# EAGLE design expansion (EAGLE 8.2.1)
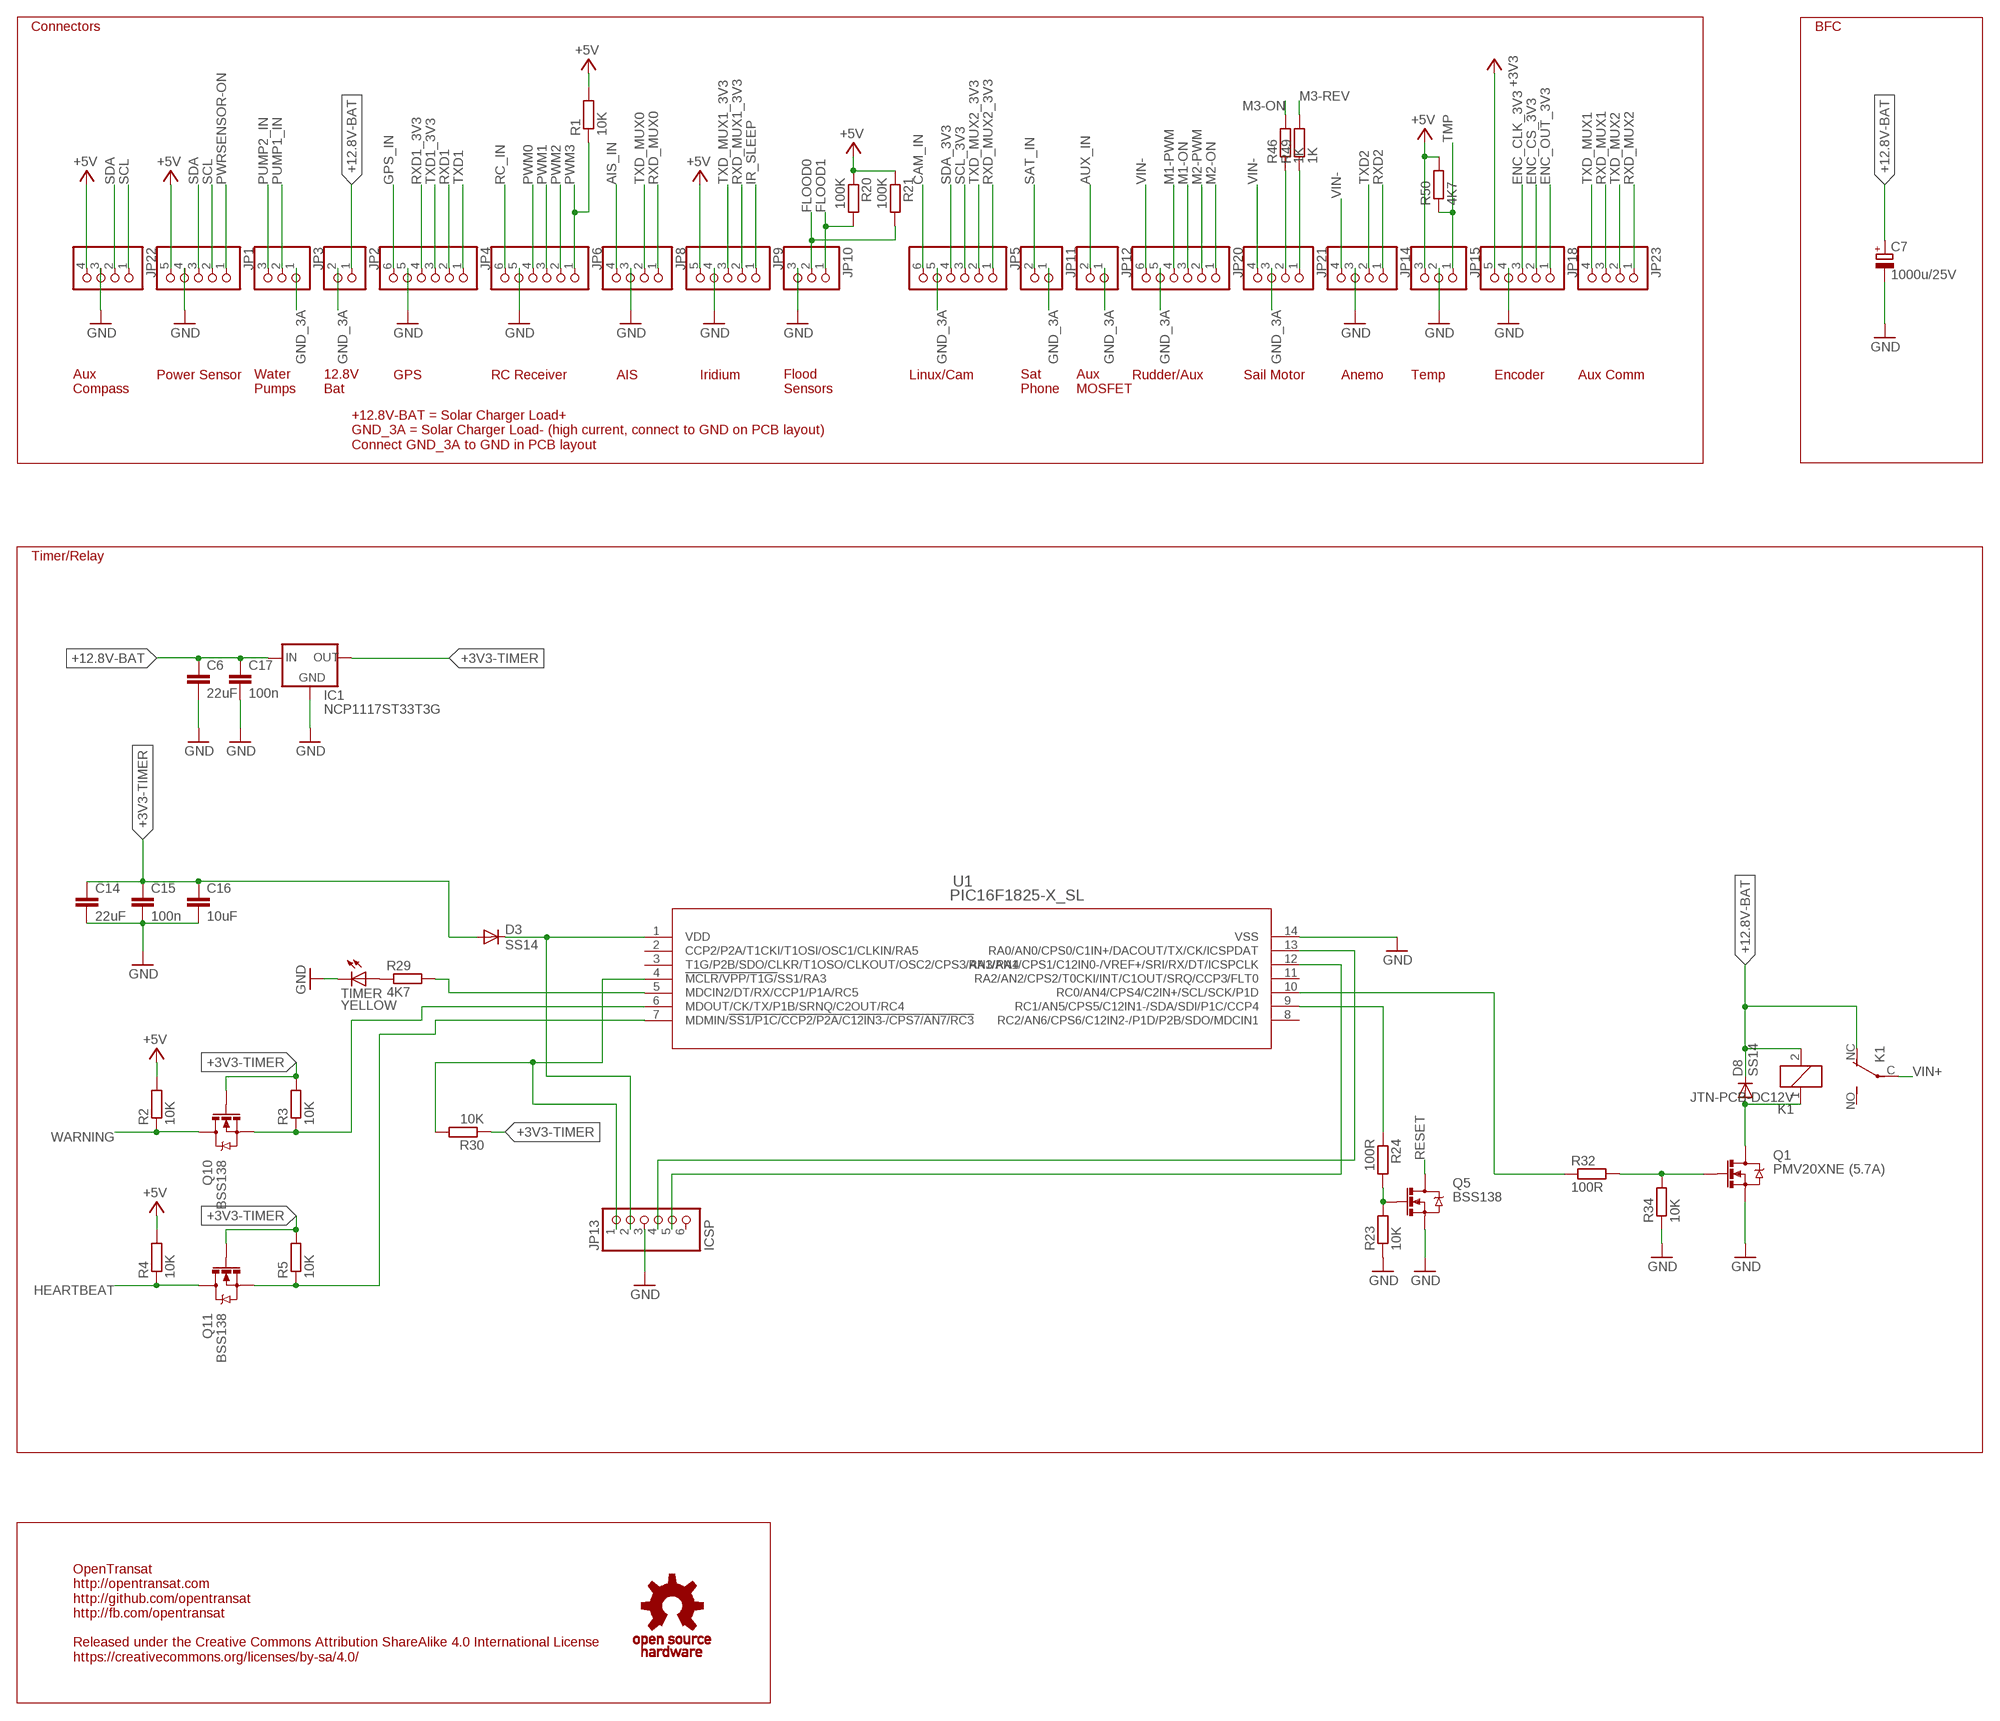
[diagram p0: schematic, sheet 1, part 1 of 2]
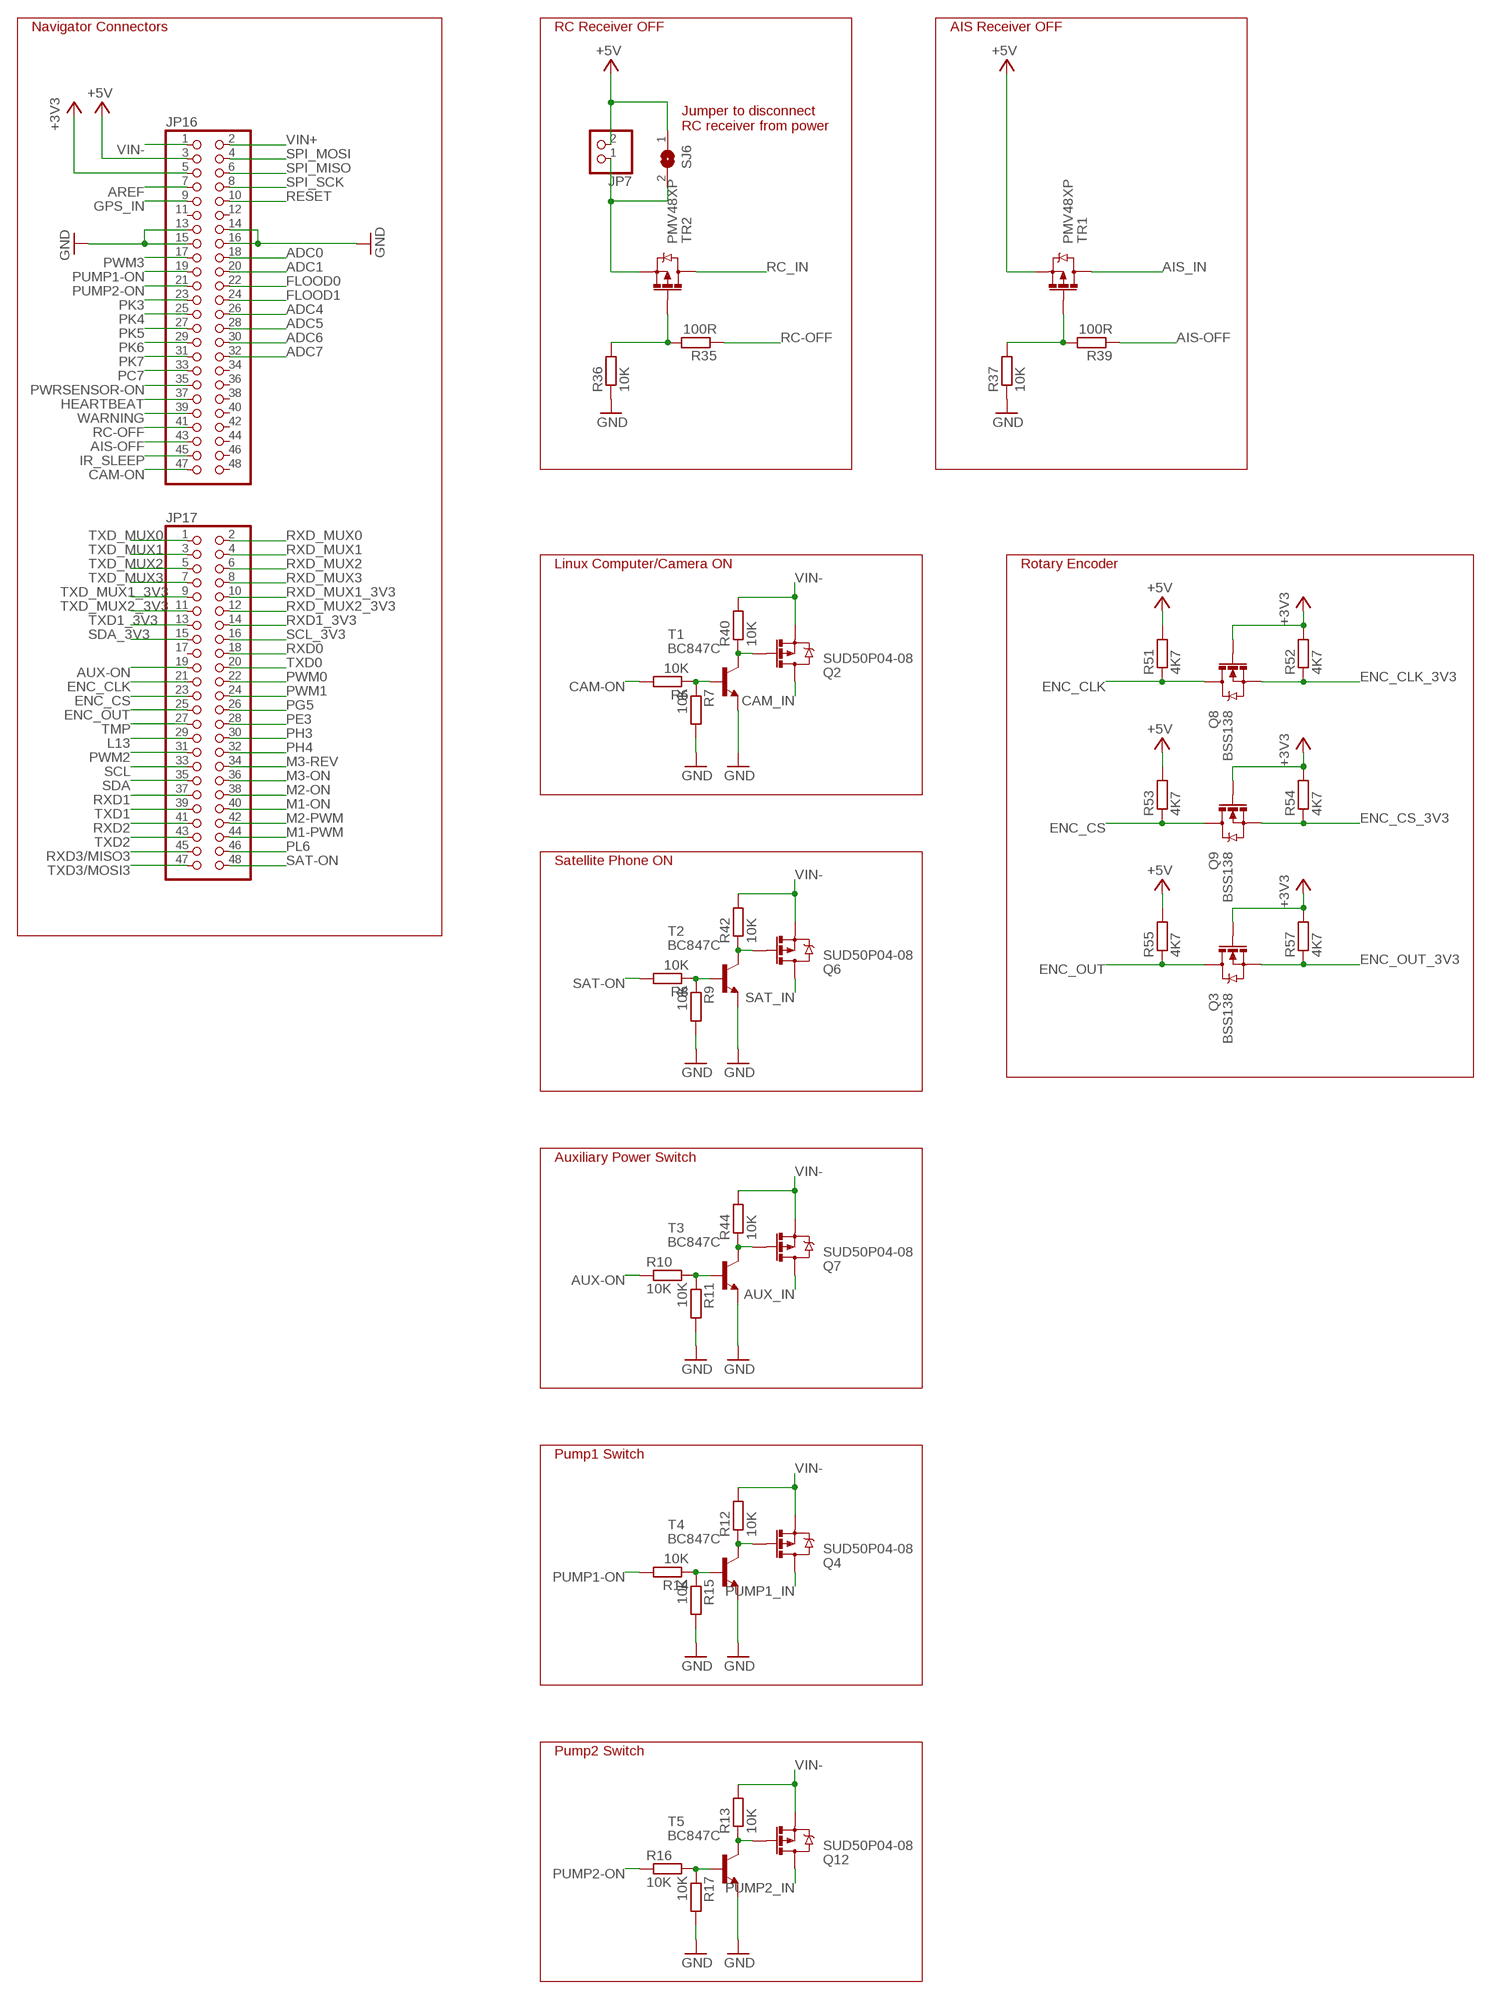
[diagram p1: schematic, sheet 1, part 2 of 2]

## Parts
C6  22uF  C-EUC1210  [C1210]
C7  1000u/25V  CPOL-EUE5-10.5  [E5-10,5]
C14  22uF  C-EUC1210  [C1210]
C15  100n  C-EUC0603  [C0603]
C16  10uF  C-EUC1206  [C1206]
C17  100n  C-EUC0603  [C0603]
D3  SS14  DIODE-DO214AC  [DO214AC]
D8  SS14  DIODE-DO214AC  [DO214AC]
IC1  NCP1117ST33T3G  LM1117MP-3.3  [SOT223]
JP1  PINHD-1X5  [1X05]
JP2  PINHD-1X2  [1X02]
JP3  PINHD-1X3  [1X03]
JP4  PINHD-1X6  [1X06]
JP5  PINHD-1X6  [1X06]
JP6  PINHD-1X6  [1X06]
JP7  PINHD-1X2  [1X02]
JP8  PINHD-1X4  [1X04]
JP9  PINHD-1X5  [1X05]
JP10  PINHD-1X3  [1X03]
JP11  PINHD-1X2  [1X02]
JP12  PINHD-1X2  [1X02]
JP13  ICSP  PINHD-1X6  [1X06]
JP14  PINHD-1X4  [1X04]
JP15  PINHD-1X3  [1X03]
JP16  PINHD-2X24  [2X24]
JP17  PINHD-2X24  [2X24]
JP18  PINHD-1X5  [1X05]
JP20  PINHD-1X6  [1X06]
JP21  PINHD-1X4  [1X04]
JP22  PINHD-1X4  [1X04]
JP23  PINHD-1X4  [1X04]
K1  JTN-PCB-DC12V  [JT-PCB]
Q1  PMV20XNE (5.7A)  MOSFET-NCHANNEL_SOT23-3  [SOT23-3]
Q2  SUD50P04-08  MOSFET-PCHANNEL_D-PAK  [D-PAK_TO252AA]
Q3  BSS138  MOSFET-NCHANNEL_SOT23-3  [SOT23-3]
Q4  SUD50P04-08  MOSFET-PCHANNEL_D-PAK  [D-PAK_TO252AA]
Q5  BSS138  MOSFET-NCHANNEL_SOT23-3  [SOT23-3]
Q6  SUD50P04-08  MOSFET-PCHANNEL_D-PAK  [D-PAK_TO252AA]
Q7  SUD50P04-08  MOSFET-PCHANNEL_D-PAK  [D-PAK_TO252AA]
Q8  BSS138  MOSFET-NCHANNEL_SOT23-3  [SOT23-3]
Q9  BSS138  MOSFET-NCHANNEL_SOT23-3  [SOT23-3]
Q10  BSS138  MOSFET-NCHANNEL_SOT23-3  [SOT23-3]
Q11  BSS138  MOSFET-NCHANNEL_SOT23-3  [SOT23-3]
Q12  SUD50P04-08  MOSFET-PCHANNEL_D-PAK  [D-PAK_TO252AA]
R1  10K  R-EU_R0603  [R0603]
R2  10K  R-EU_R0603  [R0603]
R3  10K  R-EU_R0603  [R0603]
R4  10K  R-EU_R0603  [R0603]
R5  10K  R-EU_R0603  [R0603]
R6  10K  R-EU_R0603  [R0603]
R7  10K  R-EU_R0603  [R0603]
R8  10K  R-EU_R0603  [R0603]
R9  10K  R-EU_R0603  [R0603]
R10  10K  R-EU_R0603  [R0603]
R11  10K  R-EU_R0603  [R0603]
R12  10K  R-EU_R0603  [R0603]
R13  10K  R-EU_R0603  [R0603]
R14  10K  R-EU_R0603  [R0603]
R15  10K  R-EU_R0603  [R0603]
R16  10K  R-EU_R0603  [R0603]
R17  10K  R-EU_R0603  [R0603]
R20  100K  R-EU_R0603  [R0603]
R21  100K  R-EU_R0603  [R0603]
R23  10K  R-EU_R0603  [R0603]
R24  100R  R-EU_R0603  [R0603]
R29  4K7  R-EU_R0603  [R0603]
R30  10K  R-EU_R0603  [R0603]
R32  100R  R-EU_R0603  [R0603]
R34  10K  R-EU_R0603  [R0603]
R35  100R  R-EU_R0603  [R0603]
R36  10K  R-EU_R0603  [R0603]
R37  10K  R-EU_R0603  [R0603]
R39  100R  R-EU_R0603  [R0603]
R40  10K  R-EU_R0603  [R0603]
R42  10K  R-EU_R0603  [R0603]
R44  10K  R-EU_R0603  [R0603]
R46  1K  R-EU_R0603  [R0603]
R49  1K  R-EU_R0603  [R0603]
R50  4K7  R-EU_R0603  [R0603]
R51  4K7  R-EU_R0603  [R0603]
R52  4K7  R-EU_R0603  [R0603]
R53  4K7  R-EU_R0603  [R0603]
R54  4K7  R-EU_R0603  [R0603]
R55  4K7  R-EU_R0603  [R0603]
R57  4K7  R-EU_R0603  [R0603]
SJ6  SJ  [SJ]
T1  BC847C  BC847  [SOT23]
T2  BC847C  BC847  [SOT23]
T3  BC847C  BC847  [SOT23]
T4  BC847C  BC847  [SOT23]
T5  BC847C  BC847  [SOT23]
TIMER  YELLOW  LEDCHIPLED_0805  [CHIPLED_0805]
TR1  PMV48XP  MOSFET-PCHANNEL_SOT23-3  [SOT23-3]
TR2  PMV48XP  MOSFET-PCHANNEL_SOT23-3  [SOT23-3]
U1  PIC16F1825-X_SL  [SOIC14-N_MC]
U$2  OSHW  [OSHWM]

## Nets
+3V3 [power 3.3V]: JP16.5 JP18.5 Q3.1(G) Q8.1(G) Q9.1(G) R52.2 R54.2 R57.2
+3V3-TIMER: C14.1 C15.1 C16.1 D3.A IC1.2(OUT) IC1.4(OUT) Q10.1(G) Q11.1(G) R3.2 R5.2 R30.1
+5V [power 5V]: JP1.5 JP7.2 JP9.5 JP15.3 JP16.3 JP22.4 R1.2 R2.2 R4.2 R20.1 R21.1 R50.2 R51.2 R53.2 R55.2 SJ6.1 TR1.2(S)
+12.8V-BAT [3A]: C6.1 C7.+ C17.1 D8.C IC1.3(IN) JP2.1 K1.2 K1.NC(O)
ADC0: JP16.18
ADC1: JP16.20
ADC4: JP16.26
ADC5: JP16.28
ADC6: JP16.30
ADC7: JP16.32
AIS-OFF: JP16.43 R39.1
AIS_IN: JP8.4 TR1.3(D)
AREF: JP16.7
AUX-ON: JP17.19 R10.1
AUX_IN [3A]: JP12.2 Q7.2(D)
CAM-ON: JP16.47 R6.2
CAM_IN [3A]: JP5.6 Q2.2(D)
ENC_CLK: JP17.21 Q8.3(D) R51.1
ENC_CLK_3V3: JP18.3 Q8.2(S) R52.1
ENC_CS: JP17.23 Q9.3(D) R53.1
ENC_CS_3V3: JP18.2 Q9.2(S) R54.1
ENC_OUT: JP17.25 Q3.3(D) R55.1
ENC_OUT_3V3: JP18.1 Q3.2(S) R57.1
FLOOD0: JP10.2 JP16.22 R21.2
FLOOD1: JP10.1 JP16.24 R20.2
GND [GND]: C6.2 C7.- C14.2 C15.2 C16.2 C17.2 IC1.1(GND) JP1.4 JP4.5 JP6.5 JP8.3 JP9.4 JP10.3 JP13.3 JP14.3 JP15.2 JP16.13 JP16.14 JP16.15 JP16.16 JP18.4 JP22.3 Q1.2(S) Q5.2(S) R7.2 R9.2 R11.2 R15.2 R17.2 R23.1 R34.1 R36.1 R37.1 T1.2(E) T2.2(E) T3.2(E) T4.2(E) T5.2(E) TIMER.C U1.14(VSS)
GND_3A [3A]: JP2.2 JP3.1 JP5.5 JP11.1 JP12.1 JP20.5 JP21.3
GPS_IN: JP4.6 JP16.9
HEARTBEAT: JP16.37 Q11.3(D) R4.1
IR_SLEEP: JP9.1 JP16.45
L13: JP17.29
M1-ON: JP17.40 JP20.3
M1-PWM: JP17.44 JP20.4
M2-ON: JP17.38 JP20.1
M2-PWM: JP17.42 JP20.2
M3-ON: JP17.36 R46.2
M3-REV: JP17.34 R49.2
N$1: R6.1 R7.1 T1.1(B)
N$2: Q10.2(S) R3.1 U1.6(MDOUT/CK/TX/P1B/SRNQ/C2OUT/RC4)
N$3: R8.1 R9.1 T2.1(B)
N$4: Q11.2(S) R5.1 U1.7(MDMIN/!SS1/P1C/CCP2/P2A/C12IN3-/CPS7/AN7/RC3)
N$5: R10.2 R11.1 T3.1(B)
N$6: Q4.1(G) R12.1 T4.3(C)
N$7: Q12.1(G) R13.1 T5.3(C)
N$8: R14.1 R15.1 T4.1(B)
N$9: R16.2 R17.1 T5.1(B)
N$21: JP21.2 R46.1
N$22: JP21.1 R49.1
N$30: JP13.4 U1.13(RA0/AN0/CPS0/C1IN+/DACOUT/TX/CK/ICSPDAT)
N$32: Q7.1(G) R44.1 T3.3(C)
N$33: Q6.1(G) R42.1 T2.3(C)
N$35: Q2.1(G) R40.1 T1.3(C)
N$36: JP13.1 R30.2 U1.4(!MCLR/VPP/T1G/!SS1/RA3)
N$37: JP13.5 U1.12(RA1/AN1/CPS1/C12IN0-/VREF+/SRI/RX/DT/ICSPCLK)
N$40: R32.1 U1.10(RC0/AN4/CPS4/C2IN+/SCL/SCK/P1D)
N$41: D3.C JP13.2 U1.1(VDD)
N$42: R24.1 U1.9(RC1/AN5/CPS5/C12IN1-/SDA/SDI/P1C/CCP4)
N$46: Q5.1(G) R23.2 R24.2
N$51: R29.2 U1.5(MDCIN2/DT/RX/CCP1/P1A/RC5)
N$52: R29.1 TIMER.A
N$53: Q1.1(G) R32.2 R34.2
N$54: JP7.1 SJ6.2 TR2.2(S)
N$55 [power 5V]: D8.A K1.1 Q1.3(D)
N$56: R35.2 R36.2 TR2.1(G)
N$76: R37.2 R39.2 TR1.1(G)
PC7: JP16.33
PE3: JP17.28
PG5: JP17.26
PH3: JP17.30
PH4: JP17.32
PK3: JP16.23
PK4: JP16.25
PK5: JP16.27
PK6: JP16.29
PK7: JP16.31
PL6: JP17.46
PUMP1-ON: JP16.19 R14.2
PUMP1_IN [3A]: JP3.2 Q4.2(D)
PUMP2-ON: JP16.21 R16.1
PUMP2_IN [3A]: JP3.3 Q12.2(D)
PWM0: JP6.4 JP17.22
PWM1: JP6.3 JP17.24
PWM2: JP6.2 JP17.31
PWM3: JP6.1 JP16.17 R1.1
PWRSENSOR-ON: JP1.1 JP16.35
RC-OFF: JP16.41 R35.1
RC_IN: JP6.6 TR2.3(D)
RESET: JP16.10 Q5.3(D)
RXD0: JP17.18
RXD1: JP4.2 JP17.37
RXD1_3V3: JP4.4 JP17.14
RXD2: JP14.1 JP17.41
RXD3/MISO3: JP17.45
RXD_MUX0: JP8.1 JP17.2
RXD_MUX1: JP17.4 JP23.3
RXD_MUX1_3V3: JP9.2 JP17.10
RXD_MUX2: JP17.6 JP23.1
RXD_MUX2_3V3: JP5.1 JP17.12
RXD_MUX3: JP17.8
SAT-ON: JP17.48 R8.2
SAT_IN [3A]: JP11.2 Q6.2(D)
SCL: JP1.2 JP17.33 JP22.1
SCL_3V3: JP5.3 JP17.16
SDA: JP1.3 JP17.35 JP22.2
SDA_3V3: JP5.4 JP17.15
SPI_MISO: JP16.6
SPI_MOSI: JP16.4
SPI_SCK: JP16.8
TMP: JP15.1 JP17.27 R50.1
TXD0: JP17.20
TXD1: JP4.1 JP17.39
TXD1_3V3: JP4.3 JP17.13
TXD2: JP14.2 JP17.43
TXD3/MOSI3: JP17.47
TXD_MUX0: JP8.2 JP17.1
TXD_MUX1: JP17.3 JP23.4
TXD_MUX1_3V3: JP9.3 JP17.9
TXD_MUX2: JP17.5 JP23.2
TXD_MUX2_3V3: JP5.2 JP17.11
TXD_MUX3: JP17.7
VIN+ [3A]: JP16.2 K1.C(P)
VIN- [3A]: JP14.4 JP16.1 JP20.6 JP21.4 Q2.3(S) Q4.3(S) Q6.3(S) Q7.3(S) Q12.3(S) R12.2 R13.2 R40.2 R42.2 R44.2
WARNING: JP16.39 Q10.3(D) R2.1
Unconnected: JP13.6 JP16.11 JP16.12 JP16.34 JP16.36 JP16.38 JP16.40 JP16.42 JP16.44 JP16.46 JP16.48 JP17.17 K1.NO(S) U1.2(CCP2/P2A/T1CKI/T1OSI/OSC1/CLKIN/RA5) U1.3(T1G/P2B/SDO/CLKR/T1OSO/CLKOUT/OSC2/CPS3/AN3/RA4) U1.8(RC2/AN6/CPS6/C12IN2-/P1D/P2B/SDO/MDCIN1) U1.11(RA2/AN2/CPS2/T0CKI/INT/C1OUT/SRQ/CCP3/FLT0)

## Notes on the sheet
- Connectors | BFC | Navigator Connectors | RC Receiver OFF | AIS Receiver OFF
- Jumper to disconnect
  RC receiver from power
- Power Sensor | GPS | RC Receiver | AIS | Iridium | Linux/Cam | Rudder/Aux | Sail Motor | Anemo | Temp | Encoder | Aux Comm
- Aux
  Compass
- Water
  Pumps
- 12.8V
  Bat
- Flood
  Sensors
- Sat
  Phone
- Aux
  MOSFET
- +12.8V-BAT = Solar Charger Load+
  GND_3A = Solar Charger Load- (high current, connect to GND on PCB layout)
  Connect GND_3A to GND in PCB layout
- Timer/Relay | Linux Computer/Camera ON | Rotary Encoder
- Satellite Phone ON
- Auxiliary Power Switch
- Pump1 Switch
- OpenTransat
  http://opentransat.com
  http://github.com/opentransat
  http://fb.com/opentransat
  
  Released under the Creative Commons Attribution ShareAlike 4.0 International License
  https://creativecommons.org/licenses/by-sa/4.0/
- Pump2 Switch

## Library data of the parts
C6 C14-C17 = rcl:C-EU: CAPACITOR, European symbol
C7 = transducer:CPOL-EU: POLARIZED CAPACITOR, European symbol
D3 D8 = diode:DIODE-: DIODE
IC1 = lm1117_10:LM1117?-*: 800mA Low-Dropout Linear Regulator Source: http://www.ti.com/lit/ds/symlink/lm1117-n.pdf; MF: Texas Instruments; MPN: LM1117MP-3.3; OC_FARNELL: 9778195; OC_NEWARK: 28X3416
JP1 JP9 JP18 = pinhead:PINHD-1X5: PIN HEADER
JP2 JP7 JP11 JP12 = pinhead:PINHD-1X2: PIN HEADER
JP3 JP10 JP15 = pinhead:PINHD-1X3: PIN HEADER
JP4-JP6 JP13 JP20 = pinhead:PINHD-1X6: PIN HEADER
JP8 JP14 JP21-JP23 = pinhead:PINHD-1X4: PIN HEADER
JP16 JP17 = pinhead:PINHD-2X24: PIN HEADER
K1 = relay:JT?-*: COMPACT ECONOMICAL 30 AMP. RELAY NAiS Source: http://www.mew-europe.com/.. en_ds_61212_0000.pdf; OC_FARNELL: unknown; OC_NEWARK: unknown
Q1 Q3 Q5 Q8-Q11 = Simplex-DiscreteSemi:MOSFET-NCHANNEL: Generic N-channel mosfet
Q2 Q4 Q6 Q7 Q12 TR1 TR2 = Simplex-DiscreteSemi:MOSFET-PCHANNEL: Generic P-channel mosfet
R1-R17 R20 R21 R23 R24 R29 R30 R32 R34-R37 R39 R40 R42 R44 R46 R49-R55 R57 = rcl:R-EU_: RESISTOR, European symbol
SJ6 = jumper:SJ: SMD solder JUMPER
T1-T5 = transistor:BC847: NPN TRANSISTOR
TIMER = led:LED: LED OSRAM: - CHIPLED LG R971, LG N971, LY N971, LG Q971, LY Q971, LO R971, LY R971 LH N974, LH R974 LS Q976, LO Q976, LY Q976 LO Q996 - Hyper CHIPLED LW Q18S LB Q993, LB Q99A, LB R99A - SideLED LS A670, LO A670, LY A670, LG A670, LP A670 LB A673, LV A673, LT A673, LW A673 LH A674 LY A675 LS A676, LA A676, LO A676, LY A676, LW A676 LS A679, LY A679, LG A679 - Hyper Micro SIDELED® LS Y876, LA Y876, LO Y876, LY Y876 LT Y87S - SmartLED LW L88C, LW L88S LB L89C, LB L89S, LG L890 LS L89K, LO L89K, LY L89K LS L896, LA L896, LO L896, LY L896 - TOPLED LS T670, LO T670, LY T670, LG T670, LP T670 LSG T670, LSP T670, LSY T670, LOP T670, LYG T670 LG T671, LOG T671, LSG T671 LB T673, LV T673, LT T673, LW T673 LH T674 LS T676, LA T676, LO T676, LY T676, LB T676, LH T676, LSB T676, LW T676 LB T67C, LV T67C, LT T67C, LS T67K, LO T67K, LY T67K, LW E67C LS E67B, LA E67B, LO E67B, LY E67B, LB E67C, LV E67C, LT E67C LW T67C LS T679, LY T679, LG T679 LS T770, LO T770, LY T770, LG T770, LP T770 LB T773, LV T773, LT T773, LW T773 LH T774 LS E675, LA E675, LY E675, LS T675 LS T776, LA T776, LO T776, LY T776, LB T776 LHGB T686 LT T68C, LB T68C - Hyper Mini TOPLED® LB M676 - Mini TOPLED Santana® LG M470 LS M47K, LO M47K, LY M47K Source: http://www.osram.convergy.de LUXEON: - LUMILED® LXK2-PW12-R00, LXK2-PW12-S00, LXK2-PW14-U00, LXK2-PW14-V00 LXK2-PM12-R00, LXK2-PM12-S00, LXK2-PM14-U00 LXK2-PE12-Q00, LXK2-PE12-R00, LXK2-PE12-S00, LXK2-PE14-T00, LXK2-PE14-U00 LXK2-PB12-K00, LXK2-PB12-L00, LXK2-PB12-M00, LXK2-PB14-N00, LXK2-PB14-P00, LXK2-PB14-Q00 LXK2-PR12-L00, LXK2-PR12-M00, LXK2-PR14-Q00, LXK2-PR14-R00 LXK2-PD12-Q00, LXK2-PD12-R00, LXK2-PD12-S00 LXK2-PH12-R00, LXK2-PH12-S00 LXK2-PL12-P00, LXK2-PL12-Q00, LXK2-PL12-R00 Source: www.luxeon.com KINGBRIGHT: KA-3528ASYC Source: www.kingbright.com
U1 = PIC16F1825:PIC16F1825-X_SL
U$2 = oshw:OSHW

## Net classes
1 power 5V: width 0.305 mm, drill 0.508 mm, clearance 0.203 mm
2 power 3.3V: width 0.305 mm, drill 0.508 mm, clearance 0.203 mm
3 GND: width 0.305 mm, drill 0.508 mm, clearance 0.203 mm
4 3A: width 1.372 mm, drill 1.219 mm, clearance 0.406 mm

## Board
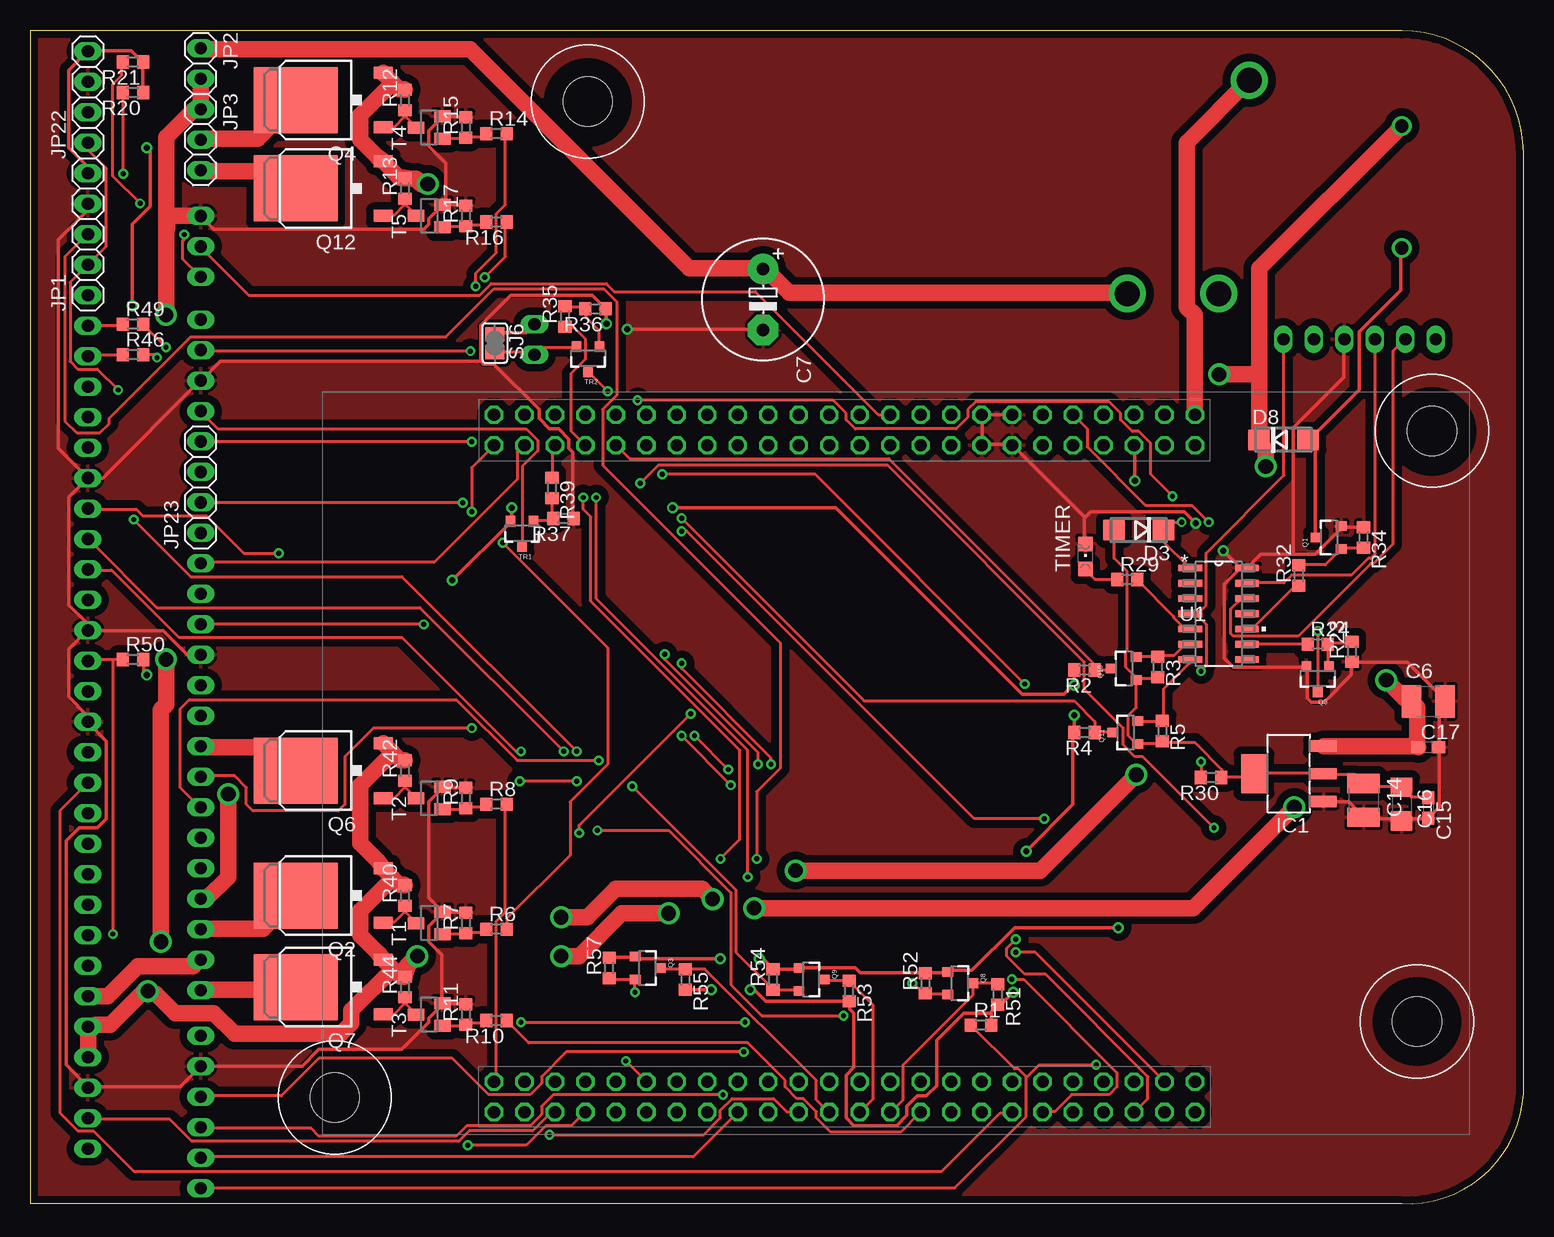
[diagram p2: board, top side]
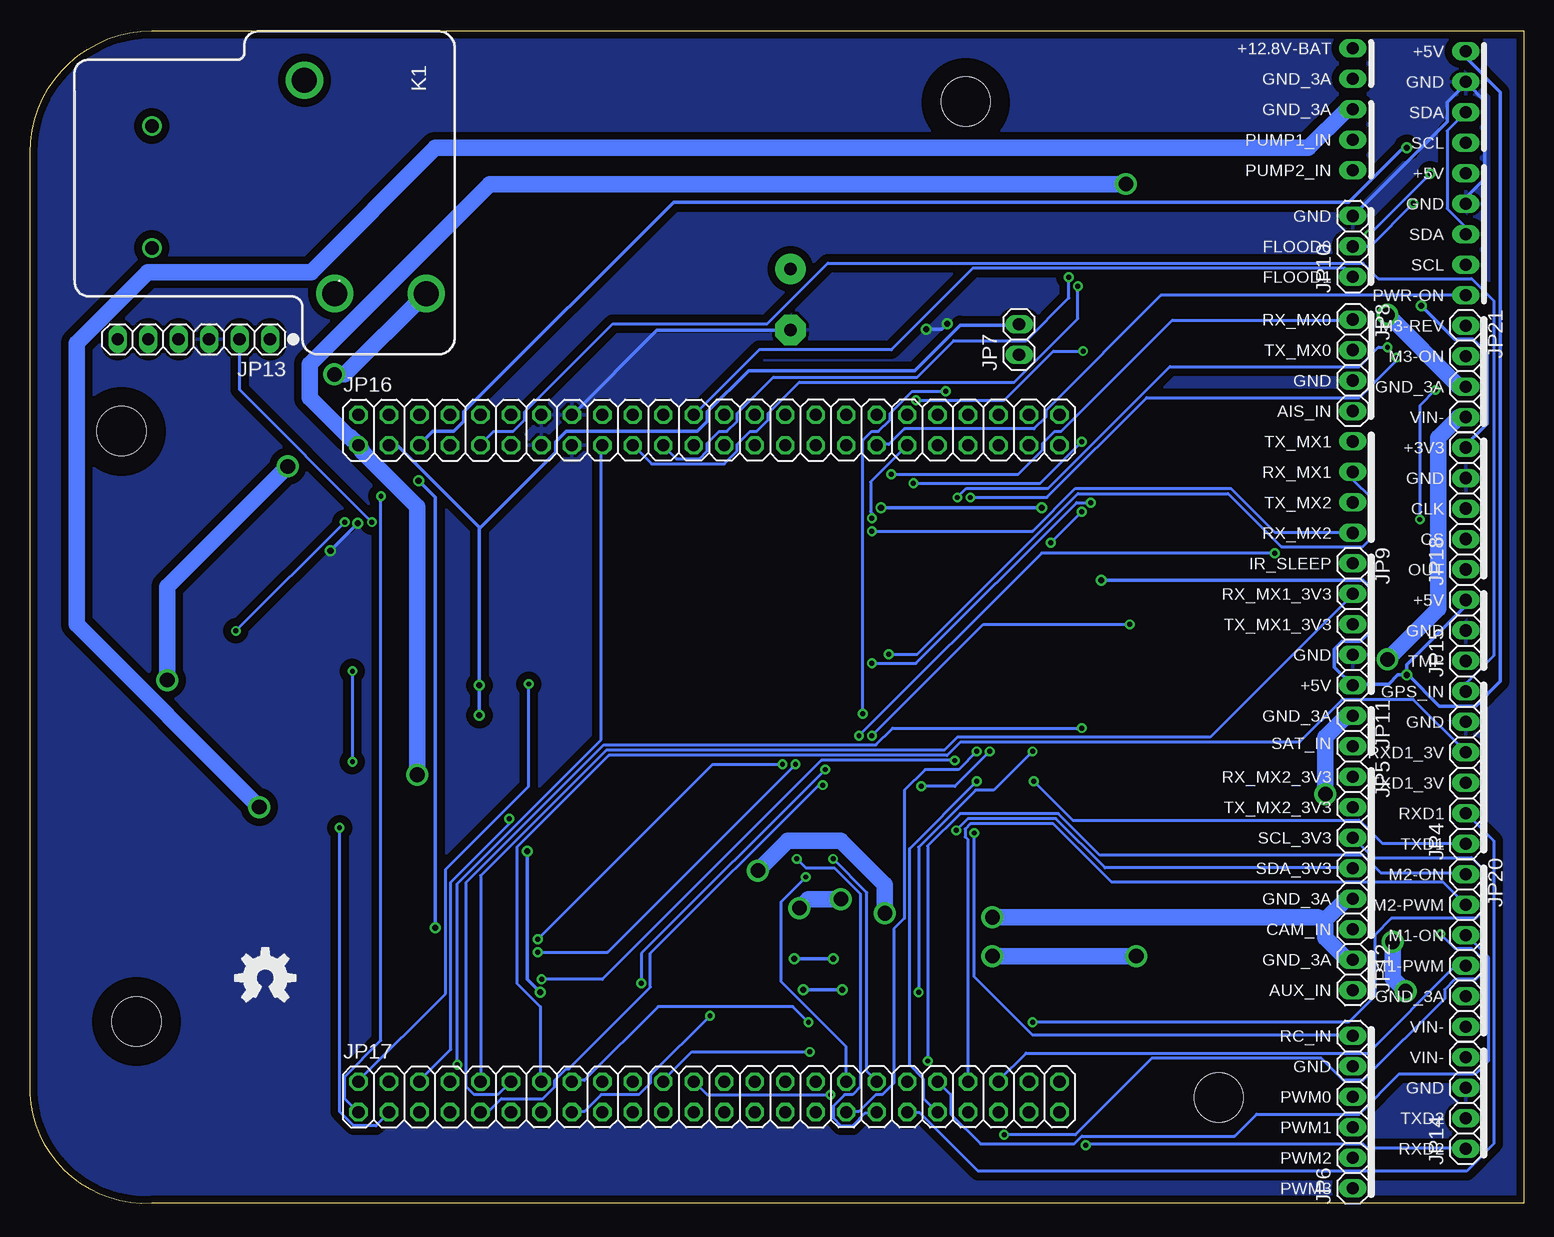
[diagram p3: board, bottom side, seen from below]

Size 124.46 x 97.73 mm. Coordinates in mm from the lower left corner, seen from the top.
Outline: 0,0.01 114.3,0.01 arc90 124.46,9.15 124.46,87.57 arc90 114.3,97.73 0,97.73 0,0.01
Copper layers (1*16): Top 0.035mm / dielectric 0.5mm / Bottom 0.035mm
Design rules "autorouter *": minimum track width 10mil, minimum drill 16mil, track to track 7mil, track to pad 7mil, pad to pad 8mil, via to via 8mil, smd to smd 8mil, copper to edge 15mil, drill to drill 12mil, minimum pad ring 10mil, minimum via ring 8mil, stop-mask expansion 1mil, vias tented up to drill 30mil, thermal gap 10mil
Holes 4.1 mm at 116.84,64.39 115.57,15.18 25.4,8.83 46.48,91.83
tRestrict: area 112.5,12.1 to 118.6,18.2; area 113.8,61.3 to 119.9,67.4; area 22.4,5.8 to 28.4,11.9; area 43.4,88.7 to 49.5,94.8
bRestrict: area 113.8,61.3 to 119.9,67.4; area 112.5,12.1 to 118.6,18.2; area 22.4,5.8 to 28.4,11.9; area 43.4,88.7 to 49.5,94.8

### Footprints (pad centres in the part's own frame; a part is rotated, then mirrored left to right if it is on the bottom)
C1210 = smd 1.6 x 2.7: 1 -1.4,0; 2 1.4,0
E5-10,5 = drill 1.016 pad 2.54: + -2.54,0 | drill 1.016 pad 2.54 octagon: - 2.54,0
C0603 = smd 1.1 x 1: 1 -0.85,0; 2 0.85,0
C1206 = smd 1.6 x 1.8: 1 -1.4,0; 2 1.4,0
DO214AC = smd 1.8 x 1.7: A 2.05,0; C -2.05,0
SOT223 = smd 0.95 x 2.15: 1 -2.3,-2.9; 2 0,-2.9; 3 2.3,-2.9 | smd 3.25 x 2.15: 4 0,2.9
1X05 = drill 1.016 long: 1 -5.08,0; 2 -2.54,0; 3 0,0; 4 2.54,0; 5 5.08,0
1X02 = drill 1.016 long: 1 -1.27,0; 2 1.27,0
1X03 = drill 1.016 long: 1 -2.54,0; 2 0,0; 3 2.54,0
1X06 = drill 1.016 long: 1 -6.35,0; 2 -3.81,0; 3 -1.27,0; 4 1.27,0; 5 3.81,0; 6 6.35,0
1X04 = drill 1.016 long: 1 -3.81,0; 2 -1.27,0; 3 1.27,0; 4 3.81,0
2X24 = drill 1.016 octagon: 1 -27.94,-1.27; 2 -27.94,1.27; 3 -25.4,-1.27; 4 -25.4,1.27; 5 -22.86,-1.27; 6 -22.86,1.27; 7 -20.32,-1.27; 8 -20.32,1.27; 9 -17.78,-1.27; 10 -17.78,1.27; 11 -15.24,-1.27; 12 -15.24,1.27; 13 -12.7,-1.27; 14 -12.7,1.27; 15 -10.16,-1.27; 16 -10.16,1.27; 17 -7.62,-1.27; 18 -7.62,1.27; 19 -5.08,-1.27; 20 -5.08,1.27; 21 -2.54,-1.27; 22 -2.54,1.27; 23 0,-1.27; 24 0,1.27; 25 2.54,-1.27; 26 2.54,1.27; 27 5.08,-1.27; 28 5.08,1.27; 29 7.62,-1.27; 30 7.62,1.27; 31 10.16,-1.27; 32 10.16,1.27; 33 12.7,-1.27; 34 12.7,1.27; 35 15.24,-1.27; 36 15.24,1.27; 37 17.78,-1.27; 38 17.78,1.27; 39 20.32,-1.27; 40 20.32,1.27; 41 22.86,-1.27; 42 22.86,1.27; 43 25.4,-1.27; 44 25.4,1.27; 45 27.94,-1.27; 46 27.94,1.27; 47 30.48,-1.27; 48 30.48,1.27
JT-PCB = drill 1.1: 1 5.08,0; 2 -5.08,0 | drill 2.1: C -8.89,12.7; NC 8.89,22.86; NO 8.89,15.24
SOT23-3 = smd 0.8 x 0.9: 1 -0.95,-1; 2 0.95,-1; 3 0,1.1
D-PAK_TO252AA = smd 1 x 1.6: 1 -2.28,-4.8; 3 2.28,-4.8 | smd 5.5 x 7: 2 0,2.5
R0603 = smd 1 x 1.1: 1 -0.85,0; 2 0.85,0
SJ = smd 1.168 x 1.6: 1 -0.762,0; 2 0.762,0
SOT23 = smd 1 x 1.4: 1 -0.95,-1.1; 2 0.95,-1.1; 3 0,1.1
CHIPLED_0805 = smd 1.2 x 1.2: A 0,-1.05; C 0,1.05
SOIC14-N_MC = smd 1.981 x 0.559: 1 -2.362,3.81; 2 -2.362,2.54; 3 -2.362,1.27; 4 -2.362,0; 5 -2.362,-1.27; 6 -2.362,-2.54; 7 -2.362,-3.81; 8 2.362,-3.81; 9 2.362,-2.54; 10 2.362,-1.27; 11 2.362,0; 12 2.362,1.27; 13 2.362,2.54; 14 2.362,3.81

### Placement (x,y rotation side)
C6  116.52,41.85 0 top
C7  61.09,75.34 270 top
C14  111.12,33.6 270 top
C15  116.52,32.96 270 top
C16  114.3,33.28 270 top
C17  116.52,38.04 0 top
D3  92.39,56.14 180 top
D8  104.46,63.63 0 top
IC1  104.9,35.82 90 top
JP1  4.83,80.78 90 top
JP2  14.22,95 270 top
JP3  14.22,88.65 270 top
JP4  4.83,36.33 90 bottom
JP5  14.22,29.22 270 bottom
JP6  14.22,7.63 90 bottom
JP7  42.04,72.01 90 bottom
JP8  14.22,69.86 270 bottom
JP9  14.22,48.27 270 bottom
JP10  14.22,79.76 90 bottom
JP11  14.22,39.38 270 bottom
JP12  14.22,19.06 270 bottom
JP13  110.81,72.01 180 bottom
JP14  4.83,8.39 90 bottom
JP15  4.83,47.76 90 bottom
JP16  69.14,64.46 0 bottom
JP17  69.14,8.89 0 bottom
JP18  4.83,57.92 90 bottom
JP20  4.83,21.09 270 bottom
JP21  4.83,69.35 270 bottom
JP22  4.83,92.21 90 top
JP23  14.22,59.7 90 top
K1  114.3,84.71 270 bottom
Q1  108.27,55.5 90 top
Q2  24.64,25.66 90 top
Q3  51.44,19.63 270 top
Q4  24.64,91.95 90 top
Q5  107.31,43.76 180 top
Q6  24.64,36.07 90 top
Q7  24.64,18.04 90 top
Q8  77.47,18.36 270 top
Q9  65.09,18.67 270 top
Q10  91.19,44.58 90 top
Q11  91.31,39.25 90 top
Q12  24.64,84.59 90 top
R1  79.25,14.86 0 top
R2  87.88,44.46 180 top
R3  93.98,44.71 270 top
R4  87.88,39.25 180 top
R5  94.36,39.38 270 top
R6  38.86,22.87 0 top
R7  36.32,23.37 90 top
R8  38.86,33.28 0 top
R9  36.32,33.79 90 top
R10  38.86,15.25 180 top
R11  36.32,15.75 90 top
R12  31.24,91.95 90 top
R13  31.24,84.59 90 top
R14  38.86,89.16 0 top
R15  36.32,89.67 90 top
R16  38.86,81.79 180 top
R17  36.32,82.3 90 top
R20  8.57,92.59 180 top
R21  8.57,95.13 180 top
R23  110.17,45.98 90 top
R24  107.31,46.61 0 top
R29  91.44,52.01 0 top
R30  98.42,35.5 180 top
R32  105.73,52.33 90 top
R34  111.12,55.5 270 top
R35  44.58,73.92 90 top
R36  47.12,74.55 180 top
R37  44.45,57.09 180 top
R39  43.5,59.63 270 top
R40  31.24,25.66 90 top
R42  31.24,36.07 90 top
R44  31.24,18.04 90 top
R46  8.57,70.74 0 top
R49  8.57,73.28 0 top
R50  8.57,45.34 0 top
R51  80.64,17.4 270 top
R52  74.61,18.36 90 top
R53  68.26,17.72 270 top
R54  61.91,18.67 90 top
R55  54.61,18.67 270 top
R57  48.26,19.63 90 top
SJ6  38.73,71.7 270 top
T1  33.27,23.37 90 top
T2  33.27,33.79 90 top
T3  33.27,15.75 90 top
T4  33.27,89.67 90 top
T5  33.27,82.3 90 top
TIMER  87.95,53.92 0 top
TR1  41.01,55.85 180 top
TR2  46.51,70.43 180 top
U1  99.06,49.15 0 top
U$2  104.86,18.8 0 top

### Tracks (layer width: path | path; a pad name or v marks a point on that pad's centre or on a via)
+3V3  (via drill 0.51)
  Top 0.305: R57.2 48.36,20.52 50.41,20.52 Q3.1 50.52,20.41 v57.54,20.41 | v60.78,20.41 61.1,20.41 61.85,19.65 R54.2 61.96,19.54 64.01,19.54 Q9.1 64.23,19.65 68.76,19.65 69.2,19.22 74.49,19.22 R52.2 74.7,19.22 76.43,19.22 Q8.1 76.54,19.44 78.48,19.44 82.04,23 v90.68,23 | v8.53,74.81 8.53,81.62 10.04,83.13 10.04,87.66 v9.72,87.98 | v92.08,60.24 92.08,63.16 JP16.5
  Bottom 0.305: v60.78,20.41 v57.54,20.41 | v8.53,74.81 5.72,72.01 4.21,72.01 3.02,70.82 3.02,64.99 4.75,63.26 4.75,63.05 JP18.5 | v9.72,87.98 10.04,87.98 14.57,83.45 70.81,83.45 88.3,65.96 88.3,65.21 89.17,64.34 90.89,64.34 91.97,63.26 JP16.5 | v90.68,23 90.68,58.84 v92.08,60.24
+3V3-TIMER
  Top 0.254: C15.1 116.48,33.9 115.08,33.9 114.32,34.66 C16.1 114.21,34.77 111.4,34.77 111.19,34.98 C14.1 111.08,35.09 110.43,35.74 107.84,35.74 IC1.2 107.73,35.84 102.12,35.84 IC1.4 101.91,35.74 101.69,35.52 99.31,35.52 R30.1 99.31,35.63 99.31,36.17 97.05,38.44 94.46,38.44 R5.2 94.35,38.44 94.24,38.33 92.41,38.33 Q11.1 92.19,38.33 91.54,38.98 91.54,40.7 92.19,41.35 92.19,43.51 Q10.1 | Q10.1 92.19,43.73 93.81,43.73 93.92,43.83 R3.2 | D3.A 90.35,56.14 90.35,53.76 91.43,52.69 91.43,46.1 91.33,45.99 91.33,44.7 92.19,43.83 Q10.1
+5V  (via drill 0.51)
  Top 0.305: R20.1 9.39,92.63 9.39,95.11 R21.1 9.28,95.22 8.42,96.08 4.86,96.08 JP22.4 4.75,95.97 3.24,94.46 3.24,87.98 4.75,86.47 4.75,85.93 JP1.5 | v35.19,51.93 40.05,56.79 TR1.2 40.16,56.9 v40.16,57.97 | v9.72,44.05 9.5,44.27 9.5,45.34 R50.2 | 80.1,15.87 80.1,15.98 80.64,16.52 R51.2 80.75,16.63 80.96,16.63 v81.93,17.6 | 80.1,15.87 80.1,14.9 R1.2 | 80.1,15.87 77.83,15.87 75.56,13.61 75.56,9.83 74.7,8.97 73.95,8.97 73.08,8.1 73.08,7.35 72.22,6.48 68.66,6.48 68.01,7.13 68.01,10.69 68.66,11.34 68.66,15.87 68.33,16.2 68.33,16.85 R53.2 68.12,16.85 61.32,16.85 60.34,17.82 v60.02,17.82 | v56.78,17.82 54.62,17.82 R55.2 | SJ6.1 38.75,72.55 41.34,72.55 41.99,73.2 JP7.2 | v87.01,40.7 87.01,39.3 R4.2 86.9,39.19 86.9,33.25 v83.01,29.37 | R2.2 87.01,44.37 v87.01,43.19 86.9,43.19 86.14,42.43 82.69,42.43 67.14,57.97 v53.54,57.97
  Bottom 0.305: v35.19,51.93 13.39,51.93 12.63,51.17 12.63,47.83 13.6,46.86 15.11,46.86 15.76,46.21 15.76,44.7 14.25,43.19 JP9.5 14.14,43.29 11.23,43.29 10.47,44.05 v9.72,44.05 | v9.72,44.05 9.72,44.91 4.86,49.77 4.86,50.2 JP15.3 | JP22.4 4.75,95.97 4.75,95.43 1.94,92.63 1.94,43.51 3.99,41.46 7.02,41.46 9.61,44.05 v9.72,44.05 | v60.02,17.82 v56.78,17.82 | v87.01,40.7 v87.01,43.19 87.01,56.36 | 87.01,56.36 93.81,63.16 94.46,63.16 JP16.3 | JP7.2 42.1,73.2 46.96,73.2 50.74,69.42 64.55,69.42 68.01,65.96 68.01,65.21 68.87,64.34 79.78,64.34 80.64,63.48 80.64,62.62 86.9,56.36 87.01,56.36 | v81.93,17.6 83.01,18.68 v83.01,29.37 | v53.54,57.97 v40.16,57.97
+12.8V-BAT  (via drill 1.22)
  Top 1.372: 115.61,38.11 115.61,41.35 115.18,41.78 C6.1 114.53,42.11 v113.02,43.62 | 115.61,38.11 C17.1 | 115.61,38.11 107.84,38.11 IC1.3 | 102.44,69.09 102.44,77.95 114.21,89.71 K1.2 | 102.44,69.09 102.44,63.7 D8.C 102.77,63.05 102.98,62.83 v102.98,61.43 | JP2.1 14.25,96.19 36.7,96.19 54.95,77.95 60.99,77.95 C7.+ 61.64,77.51 63.26,75.89 91.43,75.89 K1.NC | v99.1,69.09 102.44,69.09
  Bottom 1.372: v113.02,43.62 113.02,51.39 v102.98,61.43 | v99.1,69.09 98.23,69.09 91.54,75.79 K1.NC
AIS-OFF
  Top 0.254: R39.1 43.5,60.57 43.5,62.94 43.72,63.16 JP16.43
AIS_IN
  Top 0.254: TR1.3 41.02,54.84 41.02,61.43 42.32,62.72 42.32,63.59 41.34,64.56 15.65,64.56 14.25,65.96 JP8.4
AUX-ON
  Top 0.254: R10.1 39.73,15.23 41.56,13.39 59.8,13.39 62.94,10.26 62.94,9.72 63.91,8.75 64.45,8.75 65.53,7.67 65.53,7.13 66.71,5.94 72.54,5.94 74.16,7.56 JP17.19
AUX_IN
  Top 1.372: JP12.2 14.25,17.82 21.91,17.82 Q7.2
CAM-ON  (via drill 0.41)
  Top 0.254: v39.4,55.06 48.15,46.32 48.15,36.6 45.02,33.47 45.02,29.04 39.73,23.75 39.73,22.89 R6.2 | v36.81,57.65 36.81,61.32 38.65,63.16 JP16.47
  Bottom 0.254: v36.81,57.65 v39.4,55.06
CAM_IN
  Top 1.372: JP5.6 14.25,22.89 19.43,22.89 22.13,25.59 Q2.2
ENC_CLK
  Top 0.254: R51.1 80.64,18.36 Q8.3 78.59,18.25 78.59,17.39 72.76,11.56 72.76,8.64 71.79,7.67 JP17.21
ENC_CLK_3V3  (via drill 0.41)
  Top 0.254: Q8.2 76.43,17.49 74.7,17.49 R52.1 74.49,17.49 73.62,18.36 v73.51,18.36 | v55.38,38.98 v58.19,36.17 | v20.73,54.2 17.81,54.2 14.68,57.33 9.39,57.33 8.85,57.87 4.86,57.87 JP18.3
  Bottom 0.254: v73.51,18.36 73.51,20.84 v58.19,36.17 | v55.38,38.98 40.16,54.2 v20.73,54.2
ENC_CS
  Top 0.254: Q9.3 66.28,18.57 68.22,18.57 R53.1 68.33,18.46 70.28,16.52 70.28,8.75 69.2,7.67 JP17.23
ENC_CS_3V3  (via drill 0.41)
  Top 0.254: Q9.2 64.01,17.82 61.96,17.82 R54.1 61.85,17.93 58.83,20.95 58.83,26.13 v50.2,34.77 | v44.48,37.68 32.49,49.66 10.58,49.66 4.86,55.38 JP18.2
  Bottom 0.254: v50.2,34.77 47.39,34.77 v44.48,37.68
ENC_OUT
  Top 0.254: Q3.3 52.57,19.54 54.52,19.54 R55.1 54.73,19.54 56.24,19.54 65.53,10.26 65.53,8.64 66.5,7.67 JP17.25
ENC_OUT_3V3  (via drill 0.41)
  Top 0.254: R57.1 48.36,18.68 50.41,18.68 Q3.2 50.41,18.57 v50.41,17.6 | v40.91,37.68 40.48,37.68 30.98,47.18 12.41,47.18 6.8,52.79 4.86,52.79 JP18.1
  Bottom 0.254: v50.41,17.6 50.41,29.69 45.66,34.44 44.15,34.44 v40.91,37.68
FLOOD0  (via drill 0.41)
  Top 0.254: v9.18,83.34 6.91,85.61 6.91,93.27 7.66,94.03 7.66,95.11 R21.2 | JP16.22 71.68,65.75 70.71,65.75 60.45,76 48.69,76 48.04,76.65 38.43,76.65 37.46,75.68 18.24,75.68 14.25,79.67 JP10.2
  Bottom 0.254: v9.18,83.34 12.74,79.78 14.14,79.78 JP10.2
FLOOD1  (via drill 0.41)
  Top 0.254: v7.77,85.83 7.77,92.52 R20.2 | v12.85,80.75 12.85,80.32 12.74,80.21 12.74,78.7 14.14,77.3 JP10.1
  Bottom 0.254: v12.85,80.75 v7.77,85.83 | JP16.24 69.09,65.75 63.69,71.14 52.68,71.14 45.88,77.95 14.9,77.95 14.25,77.3 JP10.1
GND  (via drill 0.51)
  Top 0.305: IC1.1 107.84,33.47 109.89,33.47 111.08,32.28 C14.2 111.19,32.07 114.21,32.07 C16.2 114.32,31.96 114.43,32.07 116.48,32.07 C15.2 116.59,32.17 117.45,33.04 117.45,38 C17.2 117.45,38.11 117.45,41.35 117.88,41.78 C6.2 117.88,42 114.75,45.13 110.33,45.13 R23.1 110.11,45.13 110.11,44.05 107.84,41.78 106.76,41.78 106.44,42.11 106.44,44.7 Q5.2 106.22,44.7 100.29,44.7 99.53,45.45 99.53,51.61 100.83,52.9 101.36,52.9 U1.14 | R34.1 111.08,56.36 109.35,56.36 Q1.2 109.25,56.25 107.09,54.09 105.25,54.09 | 105.25,54.09 102.55,54.09 101.47,53.01 U1.14 | 105.25,54.09 105.25,64.67 109.46,68.88 109.46,72.01 JP13.3 | R9.2 36.27,34.66 34.44,34.66 T2.2 34.33,34.55 33.25,33.47 33.25,25.48 34.33,24.4 T1.2 | R11.2 36.27,16.63 34.44,16.63 T3.2 | R7.2 36.27,24.29 34.44,24.29 T1.2 | T3.2 34.33,16.85 34.33,20.73 33.25,21.81 33.25,23.11 34.33,24.19 T1.2 | T3.2 34.33,16.52 33.25,15.44 33.25,15.12 30.98,12.85 24.07,12.85 22.67,11.45 14.36,11.45 JP6.5 14.14,11.34 12.52,9.72 4.86,9.72 JP14.3 4.75,9.83 3.02,11.56 3.02,30.23 4.1,31.31 5.61,31.31 6.37,32.07 6.37,38.54 4.86,40.05 JP4.5 4.75,40.16 4.75,40.7 3.24,42.21 3.24,46.21 4.75,47.72 JP15.2 | JP16.14 81.83,65.75 79.45,65.75 JP16.16 79.34,65.64 79.34,63.26 JP16.15 79.45,63.26 81.72,63.26 JP16.13 81.93,63.16 87.87,57.22 | 87.87,57.22 87.87,55.06 TIMER.C | R17.2 36.27,83.23 34.44,83.23 T5.2 | R15.2 36.27,90.58 34.44,90.58 T4.2 34.33,90.47 33.25,89.39 33.25,88.09 34.65,86.69 34.65,83.34 T5.2 | T5.2 34.33,83.13 33.25,82.05 33.25,81.62 32.82,81.18 15.33,81.18 14.25,82.26 JP10.3 | 37.57,70.17 37.78,69.96 38.65,69.96 42.42,66.18 42.42,65.42 43.29,64.56 44.04,64.56 44.91,63.7 44.91,62.94 45.23,62.62 45.23,57.11 R37.1
  Top 0.305: 37.57,70.17 37.57,73.2 40.05,75.68 46.85,75.68 47.93,74.6 R36.1 48.04,74.49 v48.04,73.3 | JP9.4 14.14,45.78 13.06,45.78 11.12,47.72 4.97,47.72 JP15.2 | JP18.4 6.04,60.46 14.14,68.55 JP8.3 14.36,68.66 15.87,70.17 37.57,70.17 | JP15.2 4.64,47.83 4.64,48.48 3.24,49.88 3.24,58.84 4.75,60.35 JP18.4 | JP1.4 4.75,83.23 4.75,82.7 2.38,80.32 2.38,62.94 4.75,60.57 JP18.4 | v49.77,72.87 60.99,72.87 C7.- | v99.42,54.41 100.83,53.01 U1.14 | v97.16,56.68 96.18,57.65 88.41,57.65 87.98,57.22 87.87,57.22
  Top 1.372: JP10.3 11.43,82.3 11.43,81.29
  Bottom 0.305: C7.- 61.1,72.76 72.22,72.76 79.23,65.75 JP16.16 | JP1.4 4.75,83.34 4.75,83.88 3.24,85.39 3.24,91.87 4.75,93.38 JP22.3 4.86,93.27 6.37,91.76 6.37,90.14 14.14,82.37 JP10.3 | v49.77,72.87 48.47,72.87 v48.04,73.3 | v97.16,56.68 v99.42,54.41
  pour Top (isolate 0.635): -2.03,-2.53 127,-2.53 127,100.27 -2.03,100.27
  pour Bottom (isolate 0.635): -4.57,-5.07 129.54,-5.07 129.54,103.13 -4.57,103.13
GND_3A  (via drill 1.22)
  Top 1.372: JP20.5 6.48,17.28 8.96,19.76 13.6,19.76 14.14,20.3 JP12.1 | v16.52,34.12 16.52,27.21 14.79,25.48 14.25,25.48 JP5.5 | v11.34,74.06 11.34,88.85 13.6,91.12 14.14,91.12 JP3.1 14.25,91.87 14.25,93.71 JP2.2 | v44.26,23.86 46.42,23.86 48.79,26.24 56.03,26.24 v56.89,25.37 | v60.34,24.62 96.94,24.62 v105.36,33.04
  Bottom 1.372: 16.52,23.65 14.79,25.37 14.25,25.37 JP5.5 | 16.52,23.65 16.52,22.14 14.79,20.41 14.25,20.41 JP12.1 | v16.52,34.12 16.52,38.87 14.79,40.59 14.25,40.59 JP11.1 | v11.34,74.06 5.4,68.12 4.86,68.12 JP21.3 | v44.26,23.86 17.16,23.86 16.52,23.65 | v56.89,25.37 59.59,25.37 v60.34,24.62 | v105.36,33.04 120.58,48.26 120.58,71.68 114.64,77.62 101.04,77.62 90.68,87.98 17.92,87.98 14.79,91.12 14.25,91.12 JP3.1
GNDX2  (1 unrouted)
GPS_IN
  Bottom 0.254: JP4.6 4.75,42.75 4.75,43.4 2.48,45.67 2.48,75.25 4.32,77.08 12.09,77.08 13.39,78.38 57.97,78.38 63.04,73.3 75.89,73.3 83.23,65.96 83.23,65.32 84.2,64.34 85.82,64.34 86.9,63.26 JP16.9
HEARTBEAT  (via drill 0.41)
  Top 0.254: Q11.3 90.14,39.3 88.73,39.3 R4.1 88.73,39.41 88.73,40.16 87.01,41.89 69.52,41.89 v54.3,57.11
  Bottom 0.254: v54.3,57.11 54.3,57.54 54.41,57.65 54.41,60.13 51.38,63.16 JP16.37
IR_SLEEP
  Top 0.254: JP9.1 14.25,53.44 33.68,53.44 40.59,60.35 40.59,62.62 41.13,63.16 JP16.45
M1-ON
  Bottom 0.254: JP20.3 4.75,22.35 2.92,20.52 2.92,11.88 3.99,10.8 10.36,10.8 13.71,7.45 22.24,7.45 24.07,5.62 36.81,5.62 37.46,4.97 45.23,4.97 47.71,7.45 47.71,9.07 48.79,10.15 JP17.40
M1-PWM
  Bottom 0.254: JP20.4 4.86,19.76 5.72,19.76 12.95,12.53 41.45,12.53 43.72,10.26 JP17.44
M2-ON  (via drill 0.41)
  Top 0.254: v49.66,11.88 51.28,10.26 JP17.38
  Bottom 0.254: v49.66,11.88 49.66,29.8 46.96,32.5 38.75,32.5 35.3,29.04 13.39,29.04 11.87,27.53 4.86,27.53 JP20.1
M2-PWM
  Bottom 0.254: JP17.42 46.31,10.26 46.31,30.34 46.53,30.56 46.53,31.2 46.09,31.63 39.19,31.63 34.33,26.78 6.69,26.78 4.86,24.94 JP20.2
M3-ON  (via drill 0.41)
  Top 0.254: v10.58,70.5 10.36,70.71 9.5,70.71 R46.2 | v46.09,58.84 46.09,57.87 46.74,57.22 46.74,50.2 59.16,37.79 59.16,30.34 v57.54,28.72
  Bottom 0.254: v10.58,70.5 10.58,70.28 13.71,67.15 31.41,67.15 39.73,58.84 v46.09,58.84 | v57.54,28.72 54.73,25.91 54.73,11.02 53.98,10.26 JP17.36
M3-REV  (via drill 0.41)
  Top 0.254: v11.34,71.36 9.5,73.2 R49.2 | v47.17,58.84 47.17,50.42 59.8,37.79 v59.8,27.21
  Bottom 0.254: v11.34,71.36 12.09,71.36 13.71,69.74 29.47,69.74 39.62,59.59 46.42,59.59 v47.17,58.84 | v59.8,27.21 61.85,25.16 61.85,18.46 56.46,13.07 56.46,10.26 JP17.34
N$1
  Top 0.254: R6.1 38,22.78 37.78,22.57 36.38,22.57 R7.1 36.27,22.46 34.44,22.46 T1.1
N$2
  Top 0.254: Q10.2 92.19,45.56 93.92,45.56 R3.1 94.02,45.67 95.32,45.67 96.18,46.53 96.61,46.53 U1.6
N$3
  Top 0.254: R8.1 38,33.25 37.78,33.04 36.38,33.04 R9.1 36.27,32.82 34.44,32.82 T2.1
N$4
  Top 0.254: Q11.2 92.41,40.16 94.35,40.16 R5.1 94.46,40.27 94.46,42.86 96.61,45.02 96.61,45.34 U1.7
N$5
  Top 0.254: R10.2 38,15.23 37.78,15.01 36.38,15.01 R11.1 36.27,14.79 34.44,14.79 T3.1
N$6
  Top 0.254: 31.3,90.58 31.3,91.01 R12.1 | 31.3,90.58 32.17,89.71 T4.3 | Q4.1 29.47,89.71 30.33,89.71 31.2,90.58 31.3,90.58
N$7
  Top 0.254: 31.3,83.23 31.3,83.67 R13.1 | 31.3,83.23 32.17,82.37 T5.3 | Q12.1 29.47,82.37 30.33,82.37 31.2,83.23 31.3,83.23
N$8
  Top 0.254: R14.1 38,89.06 37.78,88.85 36.38,88.85 R15.1 36.27,88.74 34.44,88.74 T4.1
N$9
  Top 0.254: R16.2 38,81.72 37.78,81.51 36.38,81.51 R17.1 36.27,81.4 34.44,81.4 T5.1
N$21
  Top 0.254: R46.1 7.66,70.71 4.86,70.71 JP21.2
N$22
  Top 0.254: R49.1 7.66,73.2 4.86,73.2 JP21.1
N$30
  Top 0.254: U1.13 101.47,51.71 104.5,51.71 105.14,52.36 110.11,52.36 111.51,53.76 111.73,53.76 112.05,54.09 112.05,72.01 JP13.4
N$32
  Top 0.254: 31.3,16.63 31.3,17.17 R44.1 | 31.3,16.63 T3.3 | Q7.1 29.47,15.77 30.33,15.77 31.2,16.63 31.3,16.63
N$33
  Top 0.254: 31.3,34.66 31.3,35.2 R42.1 | 31.3,34.66 T2.3 | Q6.1 29.47,33.79 30.33,33.79 31.2,34.66 31.3,34.66
N$35
  Top 0.254: 31.3,24.29 31.3,24.73 R40.1 | 31.3,24.29 32.17,23.43 T1.3 | Q2.1 29.47,23.43 30.33,23.43 31.2,24.29 31.3,24.29
N$36  (via drill 0.41)
  Top 0.254: v97.59,36.82 97.59,35.52 R30.2 | v97.59,44.37 98.02,44.8 98.02,48.26 97.16,49.12 96.72,49.12 U1.4 97.26,49.12 98.02,49.88 98.02,54.2 104.5,60.67 104.5,72.01 JP13.1
  Bottom 0.254: v97.59,44.37 v97.59,36.82
N$37
  Top 0.254: U1.12 101.36,50.42 100.93,50.42 100.07,49.55 100.07,47.5 100.29,47.29 105.68,47.29 111.73,53.33 111.94,53.33 113.56,54.95 113.56,71.04 114.53,72.01 JP13.5
N$40
  Top 0.254: R32.1 105.68,51.39 105.36,51.39 101.91,47.94 101.47,47.94 U1.10
N$41  (via drill 0.41)
  Top 0.254: U1.1 96.61,53.01 94.46,55.17 94.46,56.14 D3.C 94.56,56.14 95.21,56.79 v95.97,56.79
  Bottom 0.254: v95.97,56.79 106.98,67.8 106.98,72.01 JP13.2
N$42
  Top 0.254: R24.1 106.44,46.64 101.47,46.64 U1.9
N$46
  Top 0.254: Q5.1 108.17,44.8 108.17,46.53 R24.2 108.27,46.64 108.38,46.75 110.11,46.75 R23.2
N$51
  Top 0.254: R29.2 92.3,51.93 95.32,48.91 95.32,48.8 96.18,47.94 96.61,47.94 U1.5
N$52
  Top 0.254: R29.1 90.57,52.04 88.73,52.04 87.98,52.79 TIMER.A
N$53
  Top 0.254: R34.2 111.08,54.63 109.35,54.63 Q1.1 109.25,54.52 107.95,53.22 105.79,53.22 R32.2
N$54
  Top 0.254: TR2.2 45.55,71.36 42.64,71.36 42.1,70.82 JP7.1 42.1,70.93 38.75,70.93 SJ6.2
N$55
  Top 0.305: Q1.3 107.09,55.6 107.09,63.05 106.55,63.59 D8.A 106.66,63.7 110.76,67.8 110.76,72.66 114.21,76.11 114.21,79.56 K1.1
N$56
  Top 0.254: TR2.1 47.39,71.47 47.39,72.76 46.31,73.84 46.31,74.49 R36.2 46.2,74.6 46.09,74.71 44.58,74.71 R35.2
N$76
  Top 0.254: TR1.1 41.99,56.9 43.4,56.9 43.5,57 R37.2 43.5,57.11 43.5,58.73 R39.2
PUMP1-ON  (via drill 0.41)
  Top 0.254: v37.13,76.43 37.13,77.51 38.86,79.24 38.86,82.48 39.62,83.23 39.62,89.06 R14.2
  Bottom 0.254: v37.13,76.43 37.13,73.74 42.42,68.45 60.34,68.45 62.94,65.86 62.94,65.32 63.91,64.34 64.45,64.34 65.53,63.26 65.53,62.72 66.61,61.64 72.65,61.64 74.16,63.16 JP16.19
PUMP1_IN
  Top 1.372: JP3.2 14.25,88.74 19,88.74 22.13,91.87 Q4.2
PUMP2-ON  (via drill 0.41)
  Top 0.254: v37.89,77.19 39.62,78.92 39.62,81.72 R16.1
  Bottom 0.254: v37.89,77.19 37.89,75.46 41.45,71.9 47.5,71.9 50.52,68.88 62.5,68.88 65.53,65.86 65.53,65.21 66.39,64.34 67.04,64.34 68.01,63.37 68.01,62.72 68.66,62.08 70.6,62.08 71.68,63.16 JP16.21
PUMP2_IN
  Top 1.372: JP3.3 14.25,86.04 20.73,86.04 22.13,84.64 Q12.2
PWM0  (via drill 0.41)
  Top 0.254: v59.48,12.64 44.69,12.64 42.64,10.58 42.64,10.04 41.67,9.07 38.21,9.07 35.19,12.1 24.07,12.1 20.94,8.97 14.25,8.97 JP6.4
  Bottom 0.254: v59.48,12.64 69.3,12.64 71.68,10.26 JP17.22
PWM1  (via drill 0.41)
  Top 0.254: v57.75,9.07 43.61,9.07 42.64,8.1 42.64,7.45 41.67,6.48 36.38,6.48 35.52,5.62 24.07,5.62 23.43,6.27 14.25,6.27 JP6.3
  Bottom 0.254: v57.75,9.07 68.01,9.07 69.09,10.15 JP17.24
PWM2
  Top 0.254: JP6.2 14.25,3.89 55.27,3.89 58.94,7.56 JP17.31
PWM3  (via drill 0.41)
  Top 0.254: 83.01,10.58 82.37,11.23 82.04,11.23 78.48,14.79 R1.1 | 83.01,10.58 83.01,7.24 77.08,1.3 14.25,1.3 JP6.1 | v88.84,11.56 84.09,11.56 83.12,10.58 83.01,10.58
  Bottom 0.254: v88.84,11.56 88.84,26.67 76.86,38.65 76.86,63.16 JP16.17
PWRSENSOR-ON
  Bottom 0.254: JP16.35 53.87,63.26 52.9,63.26 51.6,64.56 40.8,64.56 39.83,65.53 39.83,66.07 30.23,75.68 4.86,75.68 JP1.1
RC-OFF
  Top 0.254: R35.1 44.58,72.98 45.34,72.98 46.31,72.01 46.31,70.39 45.12,69.2 45.12,64.34 46.2,63.26 JP16.41
RC_IN  (via drill 0.41)
  Top 0.254: v48.15,67.69 46.53,69.31 TR2.3 | v55.05,40.81 45.77,31.53 v45.77,30.88
  Bottom 0.254: v48.15,67.69 50.95,67.69 52.79,65.86 52.79,65.32 53.76,64.34 54.3,64.34 55.05,63.59 v55.05,40.81 | v45.77,30.88 45.77,18.9 40.91,14.04 14.25,14.04 JP6.6
RESET  (via drill 0.41)
  Top 0.254: v107.3,47.72 107.3,42.75 Q5.3 | v98.23,56.79 96.83,58.19 92.94,58.19 88.09,63.05 88.09,64.56 87.01,65.64 JP16.10
  Bottom 0.254: v98.23,56.79 v107.3,47.72
RXD1
  Bottom 0.254: JP17.37 51.28,7.56 50.3,7.56 45.45,2.7 4.75,2.7 2.48,4.97 2.48,30.23 4.75,32.5 JP4.2
RXD1_3V3
  Bottom 0.254: JP17.14 81.93,10.26 81.93,16.41 83.88,18.36 83.88,29.69 76.21,37.36 48.04,37.36 46.96,38.44 18.68,38.44 15.11,42 9.18,42 4.86,37.68 JP4.4
RXD2  (via drill 0.41)
  Top 0.254: v36.49,4.86 41.34,4.86 42.96,6.48 45.12,6.48 46.2,7.56 JP17.41
  Bottom 0.254: v36.49,4.86 36.38,4.97 13.39,4.97 13.06,4.65 4.86,4.65 JP14.1
RXD_MUX0  (via drill 0.41)
  Top 0.254: v52.68,60.78 65.42,60.78 v82.91,43.29
  Bottom 0.254: v52.68,60.78 42.1,60.78 40.05,62.83 40.05,63.37 39.08,64.34 38.54,64.34 29.25,73.63 14.25,73.63 JP8.1 | v82.91,43.29 82.91,34.77 89.81,27.86 89.81,17.49 97.05,10.26 JP17.2
RXD_MUX1  (via drill 0.41)
  Top 0.254: v52.9,45.78 52.9,45.34 60.67,37.57 v60.67,36.6 | v82.15,20.95 83.77,20.95 94.46,10.26 JP17.4
  Bottom 0.254: v52.9,45.78 50.52,45.78 37.13,59.16 24.61,59.16 20.19,54.74 13.39,54.74 12.74,55.38 12.74,58.84 14.14,60.24 14.14,60.89 JP23.3 | v60.67,36.6 76.32,20.95 v82.15,20.95
RXD_MUX1_3V3
  Bottom 0.254: JP17.10 86.9,10.26 86.9,27.32 76.43,37.79 48.25,37.79 47.17,38.87 26.12,38.87 14.25,50.74 JP9.2
RXD_MUX2  (via drill 0.41)
  Top 0.254: v54.3,56.03 54.73,56.03 78.7,32.07 v84.53,32.07
  Bottom 0.254: v54.3,56.03 40.91,56.03 37.35,59.59 24.4,59.59 20.73,55.92 14.25,55.92 JP23.1 | v84.53,32.07 84.53,31.63 89.38,26.78 89.38,12.85 91.97,10.26 JP17.6
RXD_MUX2_3V3  (via drill 0.41)
  Top 0.254: v36.81,39.62 28.61,39.62 26.23,37.25 26.23,33.25 25.69,32.71 18.57,32.71 18.03,33.25 18.03,34.66 17.06,35.63 14.25,35.63 JP5.1
  Bottom 0.254: v36.81,39.62 52.57,39.62 53.98,38.22 76.64,38.22 88.09,26.78 88.09,9.72 87.44,9.07 85.5,9.07 84.42,10.15 JP17.12
SAT-ON
  Top 0.254: R8.2 39.62,33.25 39.62,24.29 38.86,23.54 38.86,10.37 38.75,10.26 JP17.48
SAT_IN
  Top 1.372: JP11.2 14.25,38 20.3,38 22.13,36.17 Q6.2
SCL  (via drill 0.41)
  Top 0.254: v45.55,37.68 30.98,52.25 13.39,52.25 v8.64,57 | v7.34,67.8 5.61,69.53 3.99,69.53 3.35,70.17 3.35,76.76 JP1.2 6.37,79.78 6.37,86.26 4.86,87.77 4.86,88.31 JP22.1
  Bottom 0.254: v45.55,37.68 47.07,36.17 49.87,36.17 51.6,34.44 51.6,23.75 52.46,22.89 52.46,10.04 53.44,9.07 53.98,9.07 55.38,7.67 56.35,7.67 JP17.33 | v8.64,57 8.64,66.5 v7.34,67.8
SCL_3V3  (via drill 0.41)
  Top 0.254: v40.91,15.12 v59.59,15.12
  Bottom 0.254: v59.59,15.12 60.88,16.41 72.11,16.41 78.26,10.26 79.23,10.26 JP17.16 | v40.91,15.12 14.57,15.12 12.41,17.28 12.41,22.35 11.01,23.75 3.99,23.75 3.35,24.4 3.35,27.86 4.32,28.83 12.52,28.83 14.14,30.45 JP5.3
SDA  (via drill 0.41)
  Top 0.254: v60.56,28.72 60.56,34.33 62.5,36.28 62.5,46.75 47.71,61.54 47.71,66.18 48.9,67.37 48.9,75.14 47.82,76.22 38.65,76.22 34.65,72.22 13.39,72.22 6.58,65.42 6.58,64.99 5.83,64.24 3.89,64.24 2.92,65.21 2.92,78.92 4.75,80.75 JP1.3
  Bottom 0.254: JP1.3 4.86,80.86 4.86,81.4 6.37,82.91 6.37,89.39 4.86,90.9 JP22.2 | v60.56,28.72 59.8,27.96 57.43,27.96 55.27,25.81 55.27,9.72 55.92,9.07 56.57,9.07 57.54,8.1 57.54,7.13 56.89,6.48 55.92,6.48 54.84,7.56 53.98,7.56 JP17.35
SDA_3V3  (via drill 0.41)
  Top 0.254: v67.79,15.66 60.99,15.66 58.4,18.25 58.4,25.91 53.22,31.1 v47.28,31.1
  Bottom 0.254: v67.79,15.66 72.76,10.69 72.76,10.04 73.73,9.07 76.86,9.07 78.26,7.67 79.23,7.67 JP17.15 | v47.28,31.1 46.31,32.07 38.97,32.07 34.87,27.96 14.25,27.96 JP5.4
TMP  (via drill 0.41)
  Top 0.254: 6.91,45.34 4.97,45.34 4.86,45.24 JP15.1 | 6.91,45.34 R50.1 | v43.29,5.73 56.13,5.73 57.54,7.13 57.54,7.78 58.51,8.75 61.96,8.75 63.04,7.67 64.01,7.67 JP17.27 | 6.91,45.34 v6.91,22.46
  Bottom 0.254: v43.29,5.73 37.35,5.73 30.98,12.1 16.84,12.1 15.01,10.26 13.39,10.26 6.58,17.06 6.58,17.82 5.72,18.68 3.99,18.68 3.35,19.33 3.35,20.3 4.32,21.27 5.72,21.27 v6.91,22.46
TXD1  (via drill 0.41)
  Top 0.254: v45.55,35.2 v40.8,35.2
  Bottom 0.254: v40.8,35.2 37.57,31.96 13.71,31.96 11.77,30.02 4.86,30.02 JP4.1 | v45.55,35.2 51.17,29.58 51.17,11.56 49.98,10.37 49.98,8.75 48.9,7.67 JP17.39
TXD1_3V3
  Top 0.254: JP4.3 2.48,32.71 2.48,7.56 3.99,6.05 5.29,6.05 8.64,2.7 76,2.7 80.86,7.56 81.83,7.56 JP17.13
TXD2
  Top 0.254: JP14.2 4.86,7.02 11.66,7.02 13.49,5.19 35.73,5.19 36.59,6.05 41.88,6.05 43.4,7.56 43.72,7.56 JP17.43
TXD_MUX0  (via drill 0.41)
  Top 0.254: v36.7,71.04 14.25,71.04 JP8.2 | v50.63,66.93 66.93,66.93 68.01,65.86 68.01,65.32 68.76,64.56 77.18,64.56 78.16,65.53 78.16,66.18 78.8,66.83 89.92,66.83 90.89,65.86 90.89,65.32 91.86,64.34 92.41,64.34 93.38,63.37 93.38,60.78 v95.21,58.95
  Bottom 0.254: v36.7,71.04 39.19,71.04 43.29,66.93 v50.63,66.93 | v95.21,58.95 95.21,13.61 98.23,10.58 98.23,8.75 97.16,7.67 JP17.1
TXD_MUX1  (via drill 0.41)
  Top 0.254: v36.81,63.48 14.25,63.48 JP23.4 | v50.84,60.03 52.36,61.54 71.46,61.54 87.87,45.13 87.87,42.86 91.11,39.62 91.11,38.22 92.08,37.25 92.73,37.25 v98.67,31.31
  Bottom 0.254: v36.81,63.48 40.27,60.03 v50.84,60.03 | v98.67,31.31 98.67,7.67 97.48,6.48 95.64,6.48 94.56,7.56 JP17.3
TXD_MUX1_3V3  (via drill 0.41)
  Top 0.254: v32.82,48.26 14.25,48.26 JP9.3 | v58.4,34.87 v54.3,38.98
  Bottom 0.254: v32.82,48.26 45.02,48.26 v54.3,38.98 | v58.4,34.87 58.73,34.87 72.76,20.84 72.76,18.03 79.56,11.23 79.78,11.23 80.75,10.26 80.75,9.72 81.72,8.75 85.17,8.75 86.25,7.67 86.9,7.67 JP17.9
TXD_MUX2  (via drill 0.41)
  Top 0.254: v36.05,58.41 14.25,58.41 JP23.2 | v54.3,45.02 54.3,44.59 61.75,37.14 v61.75,36.6 | v82.15,22.03 81.39,21.27 81.39,20.62 82.91,19.11 84.63,19.11 93.16,10.58 93.16,8.75 92.08,7.67 JP17.5
  Bottom 0.254: v36.05,58.41 37.24,58.41 50.63,45.02 v54.3,45.02 | v61.75,36.6 67.58,36.6 v82.15,22.03
TXD_MUX2_3V3  (via drill 0.41)
  Top 0.254: v81.83,18.68 82.8,18.68 90.57,10.91 90.57,9.72 89.92,9.07 86.79,9.07 85.39,7.67 84.42,7.67 JP17.11 | v47.39,36.92 40.59,36.92 35.52,42 13.28,42 12.52,41.24 12.52,34.66 14.14,33.04 JP5.2
  Bottom 0.254: v81.83,18.68 76.75,18.68 58.51,36.92 v47.39,36.92
VIN+
  Top 1.372: JP16.2 97.05,65.75 97.05,74.06 96.4,74.71 96.4,88.42 101.58,93.6 K1.C
VIN-  (via drill 1.22)
  Top 1.372: 30.23,37.57 29.47,38.33 Q6.3 | 30.23,37.57 30.87,36.92 31.2,36.92 R42.2 | 31.2,18.9 30.87,18.9 30.23,19.54 | 30.23,19.54 29.47,20.3 Q7.3 29.04,20.84 27.53,22.35 27.53,24.4 30.23,27.1 | 31.2,18.9 R44.2 | 30.23,27.1 29.47,27.86 Q2.3 29.04,28.5 27.53,30.02 27.53,34.87 30.23,37.57 | 30.23,27.1 30.77,26.56 31.2,26.56 R40.2 | JP14.4 4.86,12.2 4.86,14.69 JP20.6 5.5,14.9 6.69,14.9 9.5,17.71 v9.82,17.71 10.47,17.49 12.09,15.87 15.33,15.87 17.06,14.15 25.91,14.15 26.77,15.01 26.77,16.09 30.23,19.54 | v11.34,45.34 11.34,41.57 10.9,41.13 v10.9,21.81 | 31.2,85.5 30.77,85.5 29.47,86.8 Q12.3 28.93,87.23 27.53,88.63 27.53,90.68 30.23,93.38 | 31.2,85.5 R13.2 | 30.23,93.38 29.47,94.14 Q4.3 | 30.23,93.38 30.77,92.84 31.2,92.84 R12.2 | v33.14,84.96 32.6,84.96 32.17,85.39 31.84,85.39 31.2,85.5 | v32.28,20.62 31.41,19.76 31.41,19.54 31.2,18.9 | v44.26,20.62 45.77,20.62 49.33,24.19 v53.22,24.19 | v63.8,27.75 84.2,27.75 v92.19,35.74
  Bottom 1.372: v11.34,45.34 7.12,49.55 7.12,63.8 5.4,65.53 4.86,65.53 JP21.4 | v10.9,21.81 10.9,18.79 v9.82,17.71 | v33.14,84.96 86.14,84.96 101.15,69.96 101.15,67.15 97.91,63.91 97.8,63.91 97.16,63.26 JP16.1 96.72,62.62 92.19,58.08 v92.19,35.74 | v44.26,20.62 v32.28,20.62 | v53.22,24.19 53.22,26.56 56.89,30.23 61.32,30.23 v63.8,27.75
WARNING
  Top 0.254: Q10.3 90.03,44.48 88.73,44.48 R2.1 88.73,44.59 88.73,44.91 71.57,62.08 49.98,62.08 48.9,63.16 JP16.39

### Text on the board
_bsilk: +5V | +12.8V-BAT | GND | GND_3A | GND_3A | SDA | SCL | PUMP1_IN | PUMP2_IN | +5V | GND | GND | SDA | FLOOD0 | SCL | FLOOD1 | PWR-ON | M3-REV | RX_MX0 | TX_MX0 | M3-ON | GND_3A | GND | AIS_IN | VIN- | TX_MX1 | +3V3 | GND | RX_MX1 | TX_MX2 | CLK | CS | RX_MX2 | IR_SLEEP | OUT | +5V | RX_MX1_3V3 | TX_MX1_3V3 | GND | TMP | GND | +5V | GPS_IN | GND | GND_3A | SAT_IN | RXD1_3V | TXD1_3V | RX_MX2_3V3 | TX_MX2_3V3 | RXD1 | SCL_3V3 | TXD1 | M2-ON | SDA_3V3 | GND_3A | M2-PWM | M1-ON | CAM_IN | GND_3A | M1-PWM | GND_3A | AUX_IN | VIN- | RC_IN | VIN- | GND | GND | PWM0 | TXD2 | PWM1 | RXD2 | PWM2 | PWM3